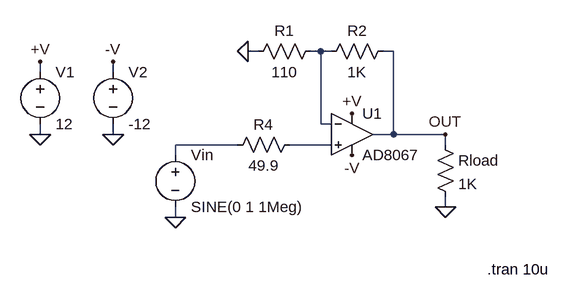
[diagram p0: schematic AD8067.asc]
AD8067.asc, the LTspice schematic file:
Version 4
SHEET 1 1240 700
WIRE 432 -1232 416 -1232
WIRE 528 -1232 512 -1232
WIRE 544 -1232 528 -1232
WIRE 640 -1232 624 -1232
WIRE 96 -1200 96 -1216
WIRE 208 -1200 208 -1216
WIRE 528 -1120 528 -1232
WIRE 544 -1120 528 -1120
WIRE 96 -1104 96 -1120
WIRE 208 -1104 208 -1120
WIRE 640 -1104 640 -1232
WIRE 640 -1104 608 -1104
WIRE 720 -1104 640 -1104
WIRE 400 -1088 304 -1088
WIRE 544 -1088 480 -1088
WIRE 720 -1088 720 -1104
WIRE 304 -1072 304 -1088
WIRE 720 -992 720 -1008
WIRE 304 -976 304 -992
FLAG 96 -1216 +V
FLAG 304 -976 0
FLAG 720 -1104 OUT
FLAG 576 -1136 +V
FLAG 208 -1216 -V
FLAG 576 -1072 -V
FLAG 416 -1232 0
FLAG 720 -992 0
FLAG 208 -1104 0
FLAG 96 -1104 0
SYMBOL voltage 96 -1216 R0
WINDOW 123 0 0 Left 2
WINDOW 39 0 0 Left 2
SYMATTR InstName V1
SYMATTR Value 12
SYMBOL voltage 304 -1088 R0
WINDOW 123 24 146 Left 2
WINDOW 39 24 125 Left 2
SYMATTR InstName Vin
SYMATTR Value SINE(0 1 1Meg)
SYMBOL res 528 -1248 R90
WINDOW 0 0 56 VBottom 2
WINDOW 3 32 56 VTop 2
SYMATTR InstName R1
SYMATTR Value 110
SYMBOL res 640 -1248 R90
WINDOW 0 0 56 VBottom 2
WINDOW 3 32 56 VTop 2
SYMATTR InstName R2
SYMATTR Value 1K
SYMBOL voltage 208 -1216 R0
WINDOW 123 24 146 Left 2
WINDOW 39 24 125 Left 2
SYMATTR InstName V2
SYMATTR Value -12
SYMBOL res 704 -1104 R0
SYMATTR InstName Rload
SYMATTR Value 1K
SYMBOL res 496 -1104 R90
WINDOW 0 0 56 VBottom 2
WINDOW 3 32 56 VTop 2
SYMATTR InstName R4
SYMATTR Value 49.9
SYMBOL Opamps\\AD8067 576 -1168 R0
SYMATTR InstName U1
TEXT 784 -896 Left 2 !.tran 10u

The netlist it stands for:
* AD8067.asc
V1 +V 0 12
Vin N002 0 SINE(0 1 1Meg)
R1 N001 0 110
R2 OUT N001 1K
V2 -V 0 -12
Rload OUT 0 1K
R4 N003 N002 49.9
XU1 N003 N001 +V -V OUT AD8067  ; pins In+ In- V+ V- OUT
.tran 10u
.backanno
.end